# Altium project PCB_Project.PrjPcb
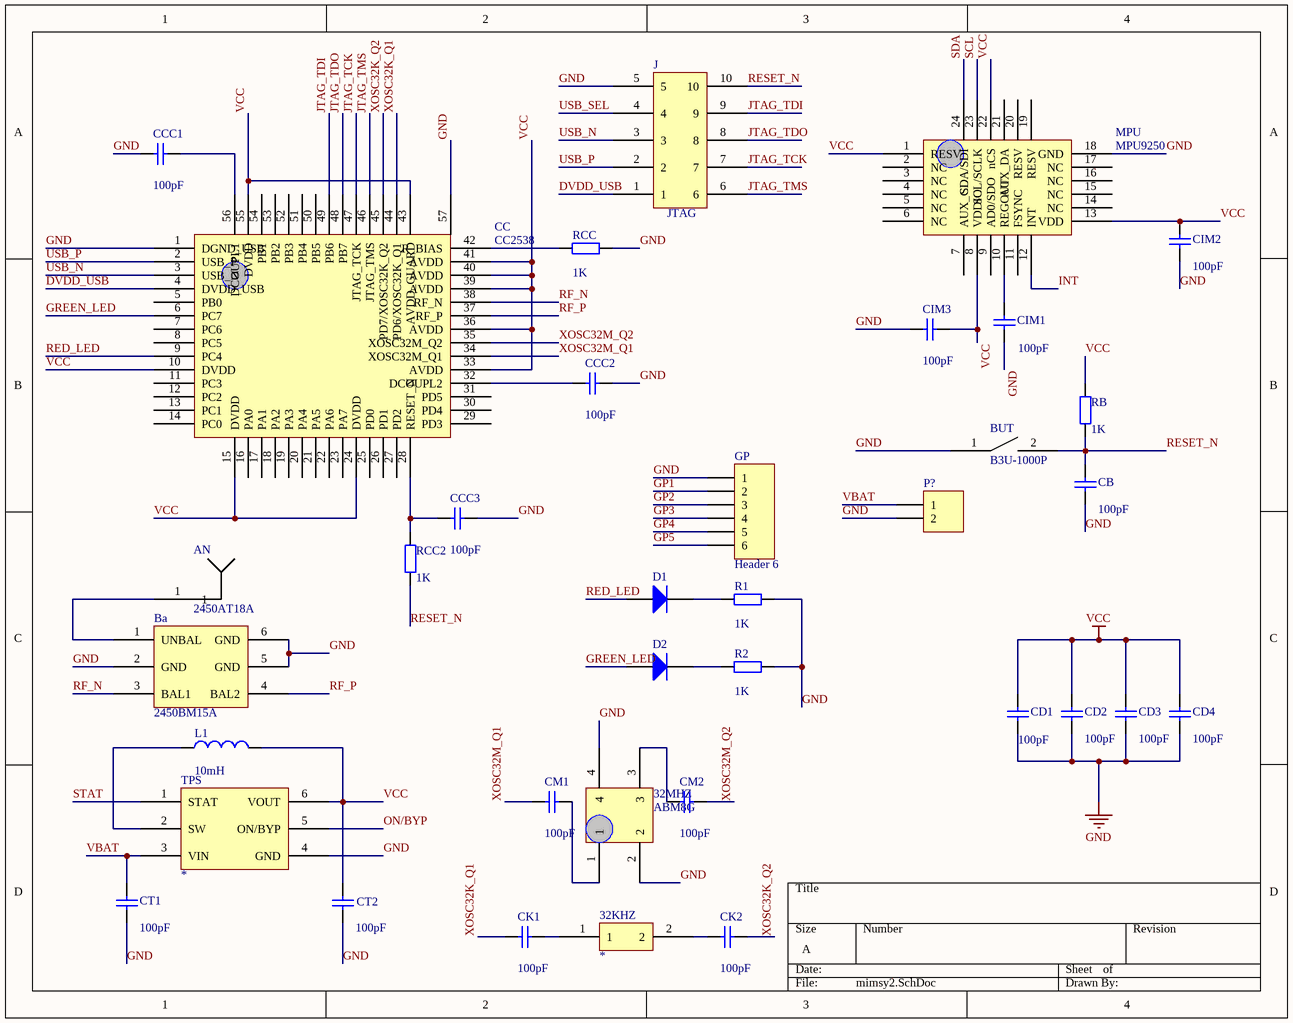
[diagram p0: mimsy2.SchDoc]
1 sheet, 36 parts. Net scope: global (net labels, ports and power ports of the same name join across sheets).
Board file: mimsy2.PcbDoc

## Sheet mimsy2.SchDoc
size A

### Parts
32KHZ  *  [32K Xtal]
32MHZ  ABM8G  [ABM8G]
AN  2450AT18A  [2450AT]
Ba  2450BM15A  [2450BM15A]
BUT  B3U-1000P  [B3U-1000P]
CB  value 100pF  [0402]
CC  CC2538  [RTQ56_6P7X6P7]
CCC1  value 100pF  [0402]
CCC2  value 100pF  [0402]
CCC3  value 100pF  [0402]
CD1  value 100pF  [0402]
CD2  value 100pF  [0402]
CD3  value 100pF  [0402]
CD4  value 100pF  [0402]
CIM1  value 100pF  [0402]
CIM2  value 100pF  [0402]
CIM3  value 100pF  [0402]
CK1  value 100pF  [0402]
CK2  value 100pF  [0402]
CM1  value 100pF  [0402]
CM2  value 100pF  [0402]
CT1  value 100pF  [0402]
CT2  value 100pF  [0402]
D1  (no value)  [0402-A]
D2  (no value)  [0402-A]
GP  Header 6  [HDR1X6]
J  JTAG  [JTAG2x5]
L1  value 10mH  [0402-A]
MPU  MPU9250  [QFN40P300X300X105-25N]
P?  (no value)  [HDR1X2]
R1  value 1K  [0402]
R2  value 1K  [0402]
RB  value 1K  [0402]
RCC  value 1K  [0402]
RCC2  value 1K  [0402]
TPS  *  [TPS62730]

### Nets
GND: 32MHZ.2 32MHZ.4 Ba.2(GND) Ba.5(GND) Ba.6(GND) BUT.1 CB.1 CC.1(DGND_USB) CC.57(GNDPAD) CCC1.1 CCC2.2 CCC3.2 CD1.1 CD2.1 CD3.1 CD4.1 CIM1.1 CIM2.1 CIM3.1 CT1.1 CT2.1 GP.1 J.5 MPU.18(GND) P?.2 R1.2 R2.2 RCC.2 TPS.4(GND)
VCC: CC.10(DVDD) CC.15(DVDD) CC.24(DVDD) CC.33(AVDD) CC.36(AVDD) CC.39(AVDD) CC.40(AVDD) CC.41(AVDD) CC.43(AVDD_GUARD) CC.55(DVDD) CD1.2 CD2.2 CD3.2 CD4.2 CIM2.2 CIM3.2 CT2.2 L1.2 MPU.1(RESV) MPU.8(VDDIO) MPU.13(VDD) MPU.22(nCS) RB.2 TPS.6(VOUT)
DVDD_USB: CC.4(DVDD_USB) J.1
GP1: GP.2
GP2: GP.3
GP3: GP.4
GP4: GP.5
GP5: GP.6
GREEN_LED: CC.6(PC7) D2.1(A)
INT: MPU.12(INT)
JTAG_TCK: CC.47(JTAG_TCK) J.7
JTAG_TDI: CC.49(PB6) J.9
JTAG_TDO: CC.48(PB7) J.8
JTAG_TMS: CC.46(JTAG_TMS) J.6
ON/BYP: TPS.5(ON/BYP)
RED_LED: CC.9(PC4) D1.1(A)
RESET_N: BUT.2 CB.2 J.10 RB.1 RCC2.1
RF_N: Ba.3(BAL1) CC.38(RF_N)
RF_P: Ba.4(BAL2) CC.37(RF_P)
SCL: MPU.23(SCL/SCLK)
SDA: MPU.24(SDA/SDI)
STAT: TPS.1(STAT)
USB_N: CC.3(USB_N) J.3
USB_P: CC.2(USB_P) J.2
USB_SEL: J.4
VBAT: CT1.2 P?.1 TPS.3(VIN)
XOSC32K_Q1: CC.44(PD6/XOSC32K_Q1) CK1.1
XOSC32K_Q2: CC.45(PD7/XOSC32K_Q2) CK2.2
XOSC32M_Q1: CC.34(XOSC32M_Q1) CM1.1
XOSC32M_Q2: CC.35(XOSC32M_Q2) CM2.2
Net32KHZ_1: 32KHZ.1 CK1.2
Net32KHZ_2: 32KHZ.2 CK2.1
Net32MHZ_1: 32MHZ.1 CM1.2
Net32MHZ_3: 32MHZ.3 CM2.1
NetAN_1: AN.1 Ba.1(UNBAL)
NetCC_28: CC.28(RESET_N) CCC3.1 RCC2.2
NetCC_32: CC.32(DCOUPL2) CCC2.1
NetCC_42: CC.42(R_BIAS) RCC.1
NetCC_56: CC.56(DCOUPL1) CCC1.2
NetCIM1_2: CIM1.2 MPU.10(REGOUT)
NetD1_2: D1.2(K) R1.1
NetD2_2: D2.2(K) R2.1
NetL1_1: L1.1 TPS.2(SW)

Not connected (* = marked no-connect by the designer): CC 5(PB0) 7(PC6) 8(PC5) 11(PC3) 12(PC2) 13(PC1) 14(PC0) 16(PA0) 17(PA1) 18(PA2) 19(PA3) 20(PA4) 21(PA5) 22(PA6) 23(PA7) 25(PD0) 26(PD1) 27(PD2) 29(PD3) 30(PD4) 31(PD5) 50(PB5) 51(PB4) 52(PB3) 53(PB2) 54(PB1); MPU 2(NC) 3(NC) 4(NC) 5(NC) 6(NC) 7(AUX_CL) 9(AD0/SDO) 11(FSYNC) 14(NC) 15(NC) 16(NC) 17(NC) 19(RESV) 20(RESV) 21(AUX_DA)

### Library data of the parts
32KHZ = ABS07: 32kHz Xtal
32MHZ = ABM8G: 32MH Xtal
AN = 2450AT18A: 2.4Ghz Ceramic Antenna
Ba = 2450BM15A: 2.4GHz Balun
CB CCC1-CCC3 CD1-CD4 CIM1-CIM3 CK1 CK2 CM1 CM2 CT1 CT2 = Cap Semi: Capacitor (Semiconductor SIM Model); Published: 8-Jun-2000; LatestRevisionDate: 29-May-2009; LatestRevisionNote: IPC-7351 Footprint Added.; PackageReference: C1206; Publisher: Altium Limited; PackageDescription: Chip Capacitor
CC = CC2538: 56-VFQFN
D1 D2 = Diode: Default Diode; Published: 8-Jun-2000; LatestRevisionDate: 17-Jul-2002; LatestRevisionNote: Re-released for DXP Platform.; PackageVersion: Sep-1996; PackageReference: SMC; Publisher: Altium Limited; PackageDescription: DO-214-AB/SMC; 2 C-Bend Leads; Body 7.9 x 5.9 mm, inc. leads (LxW); Code_JEDEC: DO-214-AB
GP = Header 6: Header, 6-Pin; LatestRevisionDate: 17-Jul-2002; LatestRevisionNote: Re-released for DXP Platform.; Publisher: Altium Limited
L1 = Inductor: Code_IEC: 1005; Published: 8-Jun-2000; LatestRevisionDate: 29-May-2009; LatestRevisionNote: IPC-7351 Footprint Added.; PackageReference: 0402-A; Publisher: Altium Limited; PackageDescription: Chip Inductor; Code_JEITA: 0402
MPU = MPU9250: 24-QFN
P? = Header 2: Header, 2-Pin; LatestRevisionDate: 17-Jul-2002; LatestRevisionNote: Re-released for DXP Platform.; Publisher: Altium Limited
R1 R2 RB RCC RCC2 = Res2: Resistor; Published: 8-Jun-2000; LatestRevisionDate: 17-Jul-2002; LatestRevisionNote: Re-released for DXP Platform.; PackageReference: AXIAL-0.4; Publisher: Altium Limited; PackageDescription: Axial Device, Thru-Hole; 2 Leads; 0.4 in Pin Spacing
TPS = TPS62730